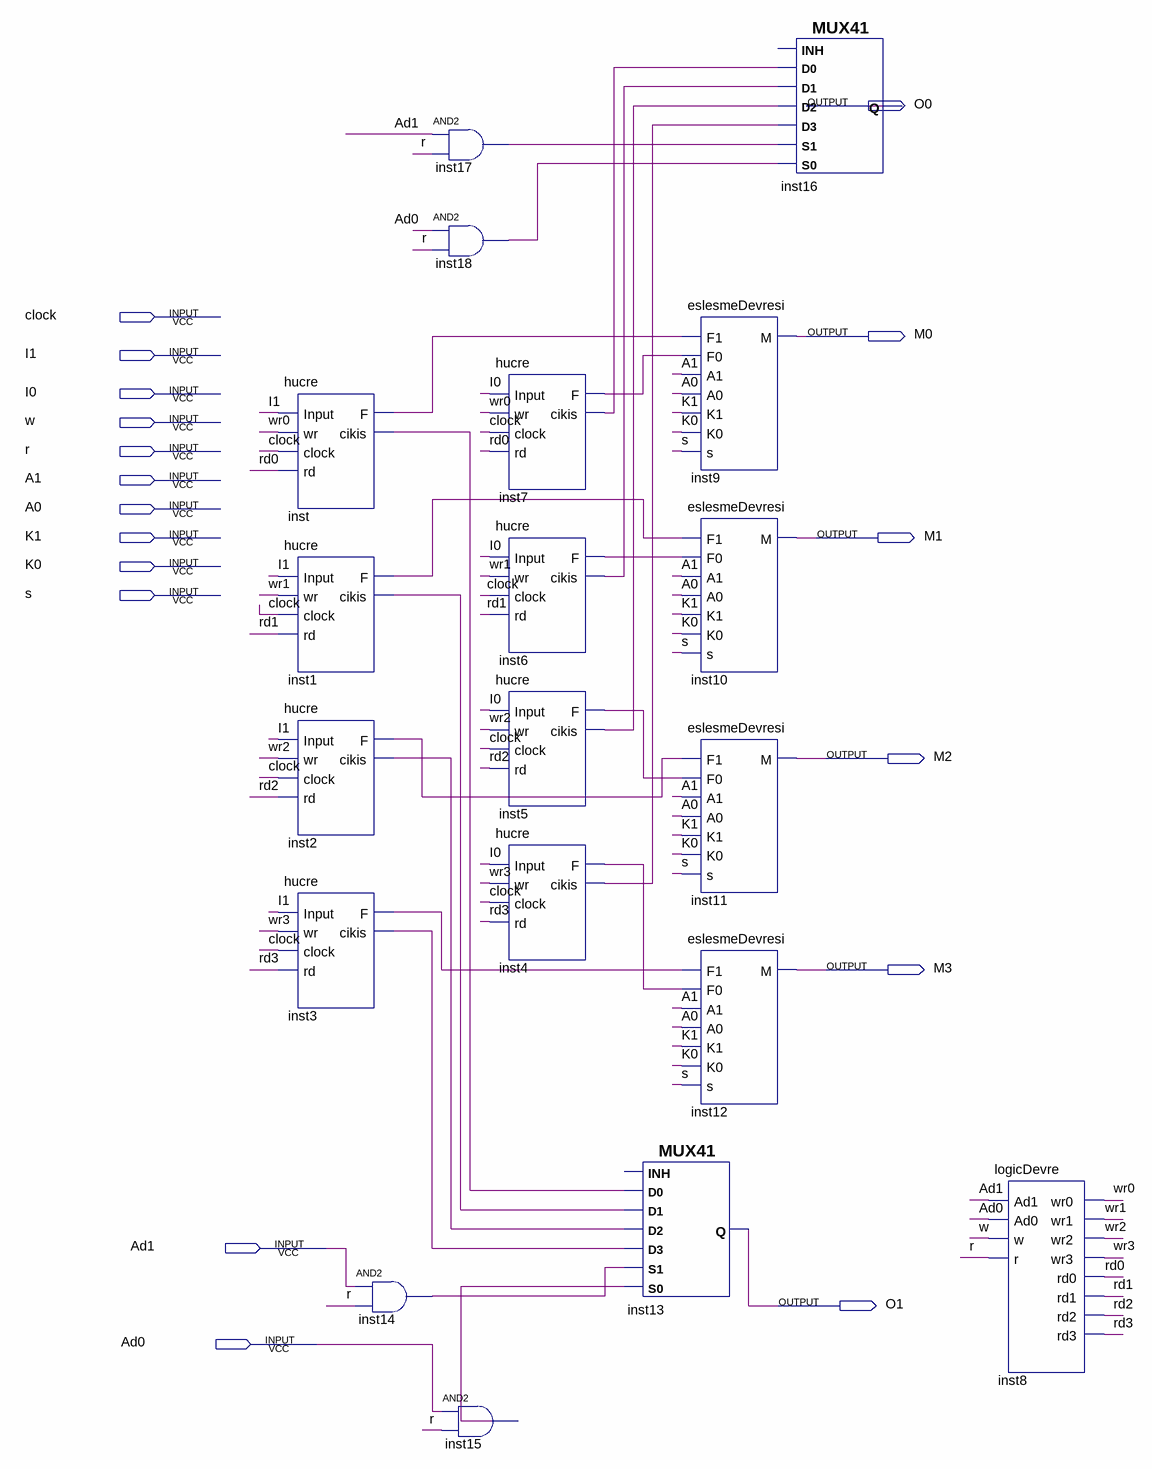
[diagram p0: schematic sheet]
// Quartus schematic BilesikDevre.bdf as structural Verilog: 19 symbols, 18 pins
module BilesikDevre (
  input  clock,
  input  I1,
  input  I0,
  input  w,
  input  r,
  input  A1,
  input  A0,
  input  K1,
  input  K0,
  input  s,
  input  Ad1,
  input  Ad0,
  output O0,
  output M0,
  output M1,
  output M2,
  output M3,
  output O1
);

  wire inst1_cikis, inst1_f, inst2_cikis, inst2_f, inst3_cikis, inst3_f, inst4_cikis, inst4_f, inst5_cikis,
       inst5_f, inst6_cikis, inst6_f, inst7_cikis, inst7_f, inst14_out, inst15_out, inst17_out, inst18_out,
       inst_cikis, inst_f, rd0, rd1, rd2, rd3, wr0, wr1, wr2, wr3;

  hucre inst (.Input(I1), .wr(wr0), .clock(clock), .rd(rd0), .F(inst_f), .cikis(inst_cikis));
  hucre inst1 (.Input(I1), .wr(wr1), .clock(clock), .rd(rd1), .F(inst1_f), .cikis(inst1_cikis));
  hucre inst2 (.Input(I1), .wr(wr2), .clock(clock), .rd(rd2), .F(inst2_f), .cikis(inst2_cikis));
  hucre inst3 (.Input(I1), .wr(wr3), .clock(clock), .rd(rd3), .F(inst3_f), .cikis(inst3_cikis));
  and inst14 (inst14_out, Ad1, r);
  and inst17 (inst17_out, Ad1, r);
  and inst18 (inst18_out, Ad0, r);
  and inst15 (inst15_out, Ad0, r);
  hucre inst7 (.Input(I0), .wr(wr0), .clock(clock), .rd(rd0), .F(inst7_f), .cikis(inst7_cikis));
  hucre inst6 (.Input(I0), .wr(wr1), .clock(clock), .rd(rd1), .F(inst6_f), .cikis(inst6_cikis));
  hucre inst5 (.Input(I0), .wr(wr2), .clock(clock), .rd(rd2), .F(inst5_f), .cikis(inst5_cikis));
  hucre inst4 (.Input(I0), .wr(wr3), .clock(clock), .rd(rd3), .F(inst4_f), .cikis(inst4_cikis));
  eslesmeDevresi inst9 (.F1(inst_f), .F0(inst7_f), .A1(A1), .A0(A0), .K1(K1), .K0(K0), .s(s), .M(M0));
  eslesmeDevresi inst10 (.F1(inst1_f), .F0(inst6_f), .A1(A1), .A0(A0), .K1(K1), .K0(K0), .s(s), .M(M1));
  eslesmeDevresi inst11 (.F1(inst2_f), .F0(inst5_f), .A1(A1), .A0(A0), .K1(K1), .K0(K0), .s(s), .M(M2));
  eslesmeDevresi inst12 (.F1(inst3_f), .F0(inst4_f), .A1(A1), .A0(A0), .K1(K1), .K0(K0), .s(s), .M(M3));
  MUX41 inst13 (
    .S0(inst15_out), .D2(inst2_cikis), .S1(inst14_out), .D3(inst3_cikis), .D0(inst_cikis), .D1(inst1_cikis),
    .Q(O1));  // open: INH
  MUX41 inst16 (
    .S0(inst18_out), .D2(inst5_cikis), .S1(inst17_out), .D3(inst4_cikis), .D0(inst7_cikis), .D1(inst6_cikis),
    .Q(O0));  // open: INH
  logicDevre inst8 (
    .Ad1(Ad1), .Ad0(Ad0), .w(w), .r(r), .wr0(wr0), .wr1(wr1), .wr2(wr2), .wr3(wr3), .rd0(rd0), .rd1(rd1),
    .rd2(rd2), .rd3(rd3));
endmodule
